# EAGLE schematic Arduino PyunPyun (EAGLE 6.6.0)
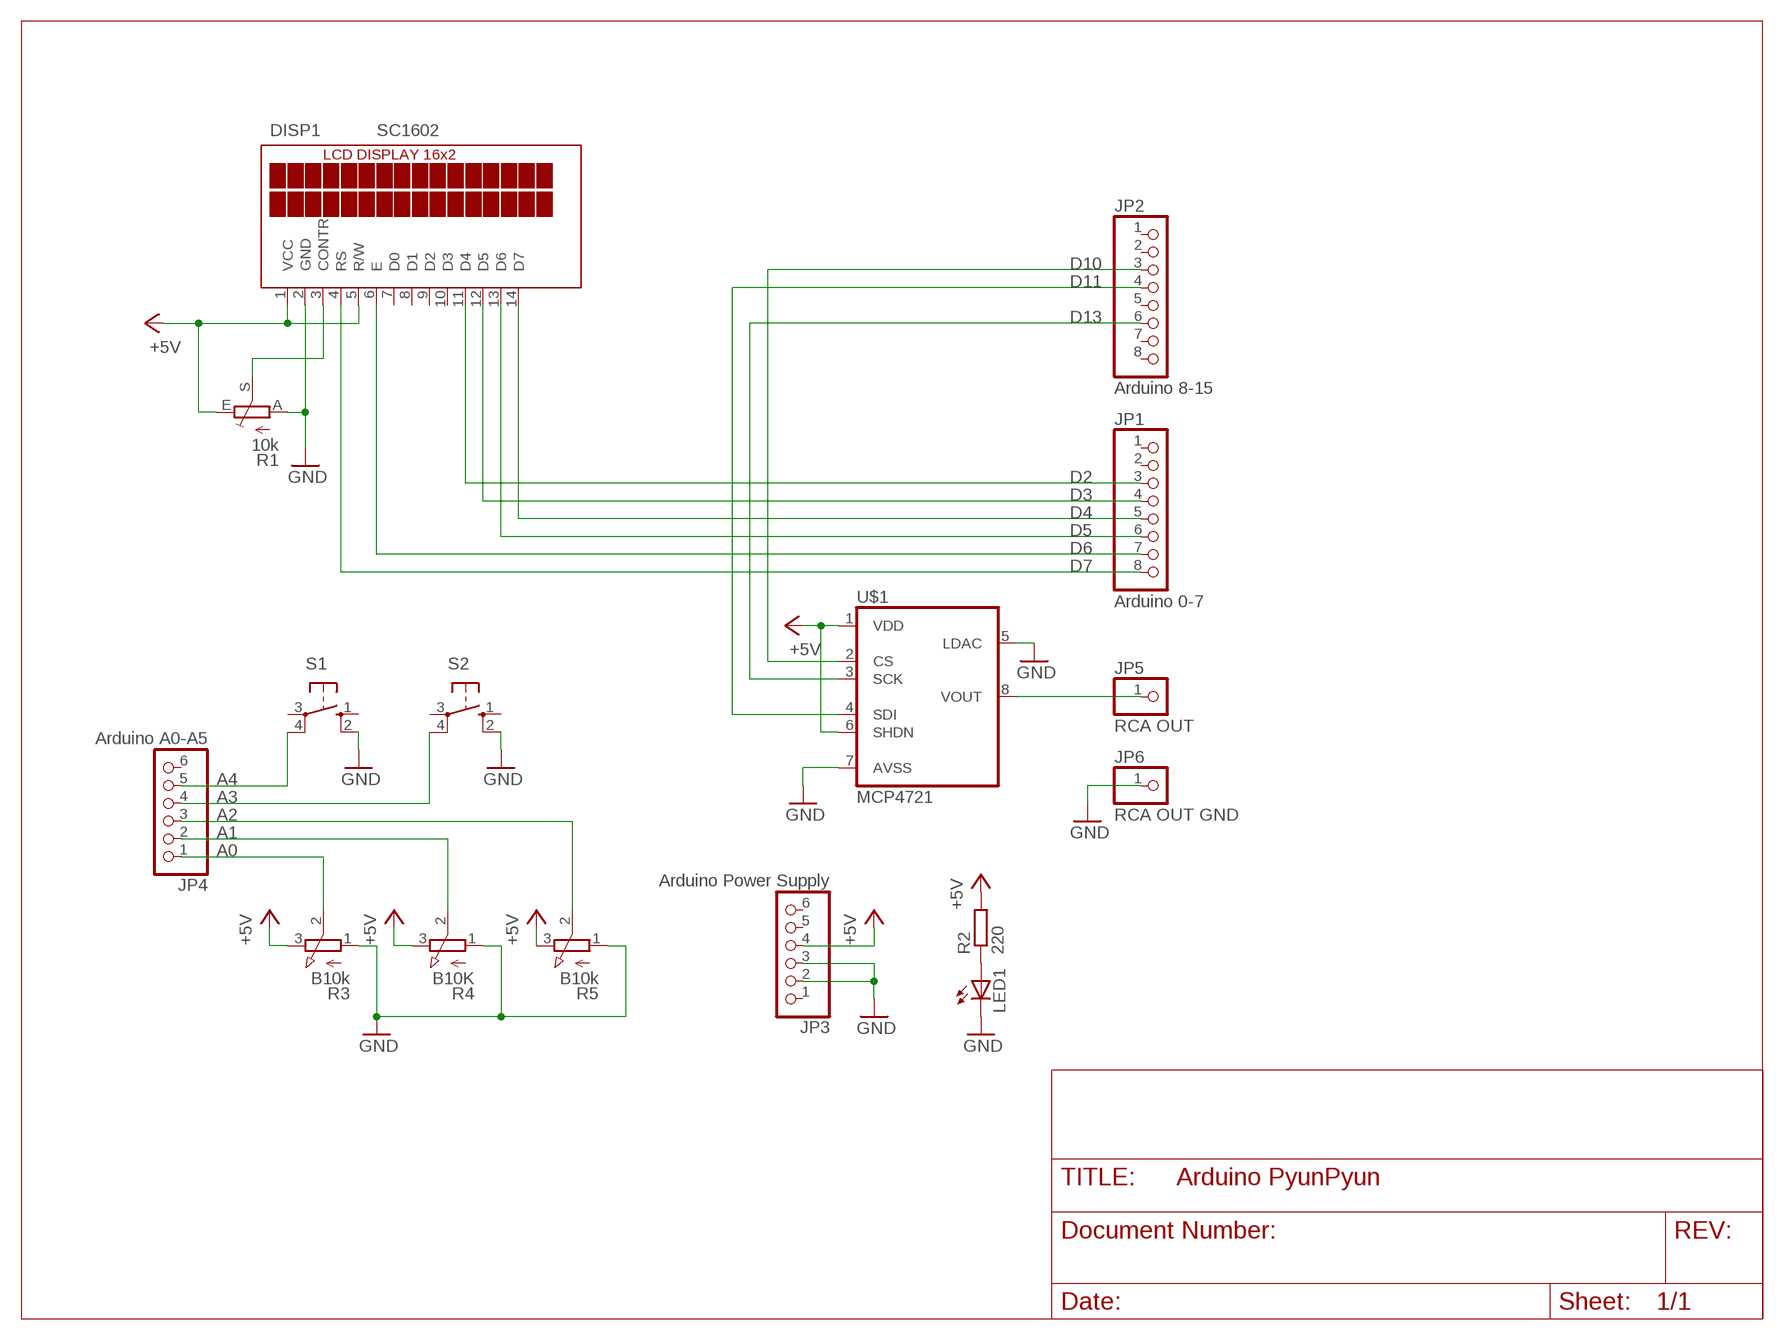
[diagram p0: schematic, sheet 1]

## Parts
DISP1  SC1602  [SC1602]
JP1  Arduino 0-7  PINHD-1X8  [1X08]
JP2  Arduino 8-15  PINHD-1X8  [1X08]
JP3  Arduino Power Supply  PINHD-1X6  [1X06]
JP4  Arduino A0-A5  PINHD-1X6  [1X06]
JP5  RCA OUT  PINHD-1X1  [1X01]
JP6  RCA OUT GND  PINHD-1X1  [1X01]
LED1  LED5MM  [LED5MM]
R1  10k  TRIM_EU-B25P  [B25P]
R2  220  R-EU_0207/7  [0207/7]
R3  B10k  3RP/1610N  [3RP/1610N]
R4  B10K  3RP/1610N  [3RP/1610N]
R5  B10k  3RP/1610N  [3RP/1610N]
S1  40-XX  [B3F-40XX]
S2  40-XX  [B3F-40XX]
U$1  MCP4721  [MCP4721]

## Nets
+5V: DISP1.1(VCC) DISP1.5(R/W) JP3.4 R1.E R2.2 R3.3(E) R4.3(E) R5.3(E) U$1.1(VDD) U$1.6(SHDN)
A0: JP4.1 R3.2(S)
A1: JP4.2 R4.2(S)
A2: JP4.3 R5.2(S)
A3: JP4.4 S2.4(P1)
A4: JP4.5 S1.4(P1)
D2: DISP1.11(D4) JP1.3
D3: DISP1.12(D5) JP1.4
D4: DISP1.14(D7) JP1.5
D5: DISP1.13(D6) JP1.6
D6: DISP1.6(E) JP1.7
D7: DISP1.4(RS) JP1.8
D10: JP2.3 U$1.2(CS)
D11: JP2.4 U$1.4(SDI)
D13: JP2.6 U$1.3(SCK)
GND: DISP1.2(GND) JP3.2 JP3.3 JP6.1 LED1.K(C) R1.A R3.1(A) R4.1(A) R5.1(A) S1.2(S1) S2.2(S1) U$1.5(LDAC) U$1.7(AVSS)
N$1: LED1.A R2.1
N$2: JP5.1 U$1.8(VOUT)
N$8: DISP1.3(CONTR) R1.S
Unconnected: DISP1.7(D0) DISP1.8(D1) DISP1.9(D2) DISP1.10(D3) JP1.1 JP1.2 JP2.1 JP2.2 JP2.5 JP2.7 JP2.8 JP3.1 JP3.5 JP3.6 JP4.6 S1.1(S) S1.3(P) S2.1(S) S2.3(P)

## Library data of the parts
DISP1 = Mylib:SC1602: ＬＣＤキャラクタディスプレイモジュール １６×２行 HD44780コンパチブル
JP1 JP2 = pinhead:PINHD-1X8: PIN HEADER
JP3 JP4 = pinhead:PINHD-1X6: PIN HEADER
JP5 JP6 = pinhead:PINHD-1X1: PIN HEADER
LED1 = led:LED: LED OSRAM: - CHIPLED LG R971, LG N971, LY N971, LG Q971, LY Q971, LO R971, LY R971 LH N974, LH R974 LS Q976, LO Q976, LY Q976 LO Q996 - Hyper CHIPLED LW Q18S LB Q993, LB Q99A, LB R99A - SideLED LS A670, LO A670, LY A670, LG A670, LP A670 LB A673, LV A673, LT A673, LW A673 LH A674 LY A675 LS A676, LA A676, LO A676, LY A676, LW A676 LS A679, LY A679, LG A679 - Hyper Micro SIDELED® LS Y876, LA Y876, LO Y876, LY Y876 LT Y87S - SmartLED LW L88C, LW L88S LB L89C, LB L89S, LG L890 LS L89K, LO L89K, LY L89K LS L896, LA L896, LO L896, LY L896 - TOPLED LS T670, LO T670, LY T670, LG T670, LP T670 LSG T670, LSP T670, LSY T670, LOP T670, LYG T670 LG T671, LOG T671, LSG T671 LB T673, LV T673, LT T673, LW T673 LH T674 LS T676, LA T676, LO T676, LY T676, LB T676, LH T676, LSB T676, LW T676 LB T67C, LV T67C, LT T67C, LS T67K, LO T67K, LY T67K, LW E67C LS E67B, LA E67B, LO E67B, LY E67B, LB E67C, LV E67C, LT E67C LW T67C LS T679, LY T679, LG T679 LS T770, LO T770, LY T770, LG T770, LP T770 LB T773, LV T773, LT T773, LW T773 LH T774 LS E675, LA E675, LY E675, LS T675 LS T776, LA T776, LO T776, LY T776, LB T776 LHGB T686 LT T68C, LB T68C - Hyper Mini TOPLED® LB M676 - Mini TOPLED Santana® LG M470 LS M47K, LO M47K, LY M47K Source: http://www.osram.convergy.de LUXEON: - LUMILED® LXK2-PW12-R00, LXK2-PW12-S00, LXK2-PW14-U00, LXK2-PW14-V00 LXK2-PM12-R00, LXK2-PM12-S00, LXK2-PM14-U00 LXK2-PE12-Q00, LXK2-PE12-R00, LXK2-PE12-S00, LXK2-PE14-T00, LXK2-PE14-U00 LXK2-PB12-K00, LXK2-PB12-L00, LXK2-PB12-M00, LXK2-PB14-N00, LXK2-PB14-P00, LXK2-PB14-Q00 LXK2-PR12-L00, LXK2-PR12-M00, LXK2-PR14-Q00, LXK2-PR14-R00 LXK2-PD12-Q00, LXK2-PD12-R00, LXK2-PD12-S00 LXK2-PH12-R00, LXK2-PH12-S00 LXK2-PL12-P00, LXK2-PL12-Q00, LXK2-PL12-R00 Source: www.luxeon.com KINGBRIGHT: KA-3528ASYC Source: www.kingbright.com
R1 = pot:TRIM_EU-: POTENTIOMETER
R2 = rcl:R-EU_: RESISTOR, European symbol
R3-R5 = pot:3RP/1610N: 16mm Potentiometer one level Source: http://www.alphapotentiometers.net/html/16mm_pot_2.html
S1 S2 = switch-omron:40-XX: OMRON SWITCH; MF: OMRON COMPONENTS USA; MPN: B3F-4000; OC_FARNELL: 176434; OC_NEWARK: 36K3105
U$1 = Mylib:MCP4721